# Altium schematic sheet 06.SchDoc
size 386 x 246 mm
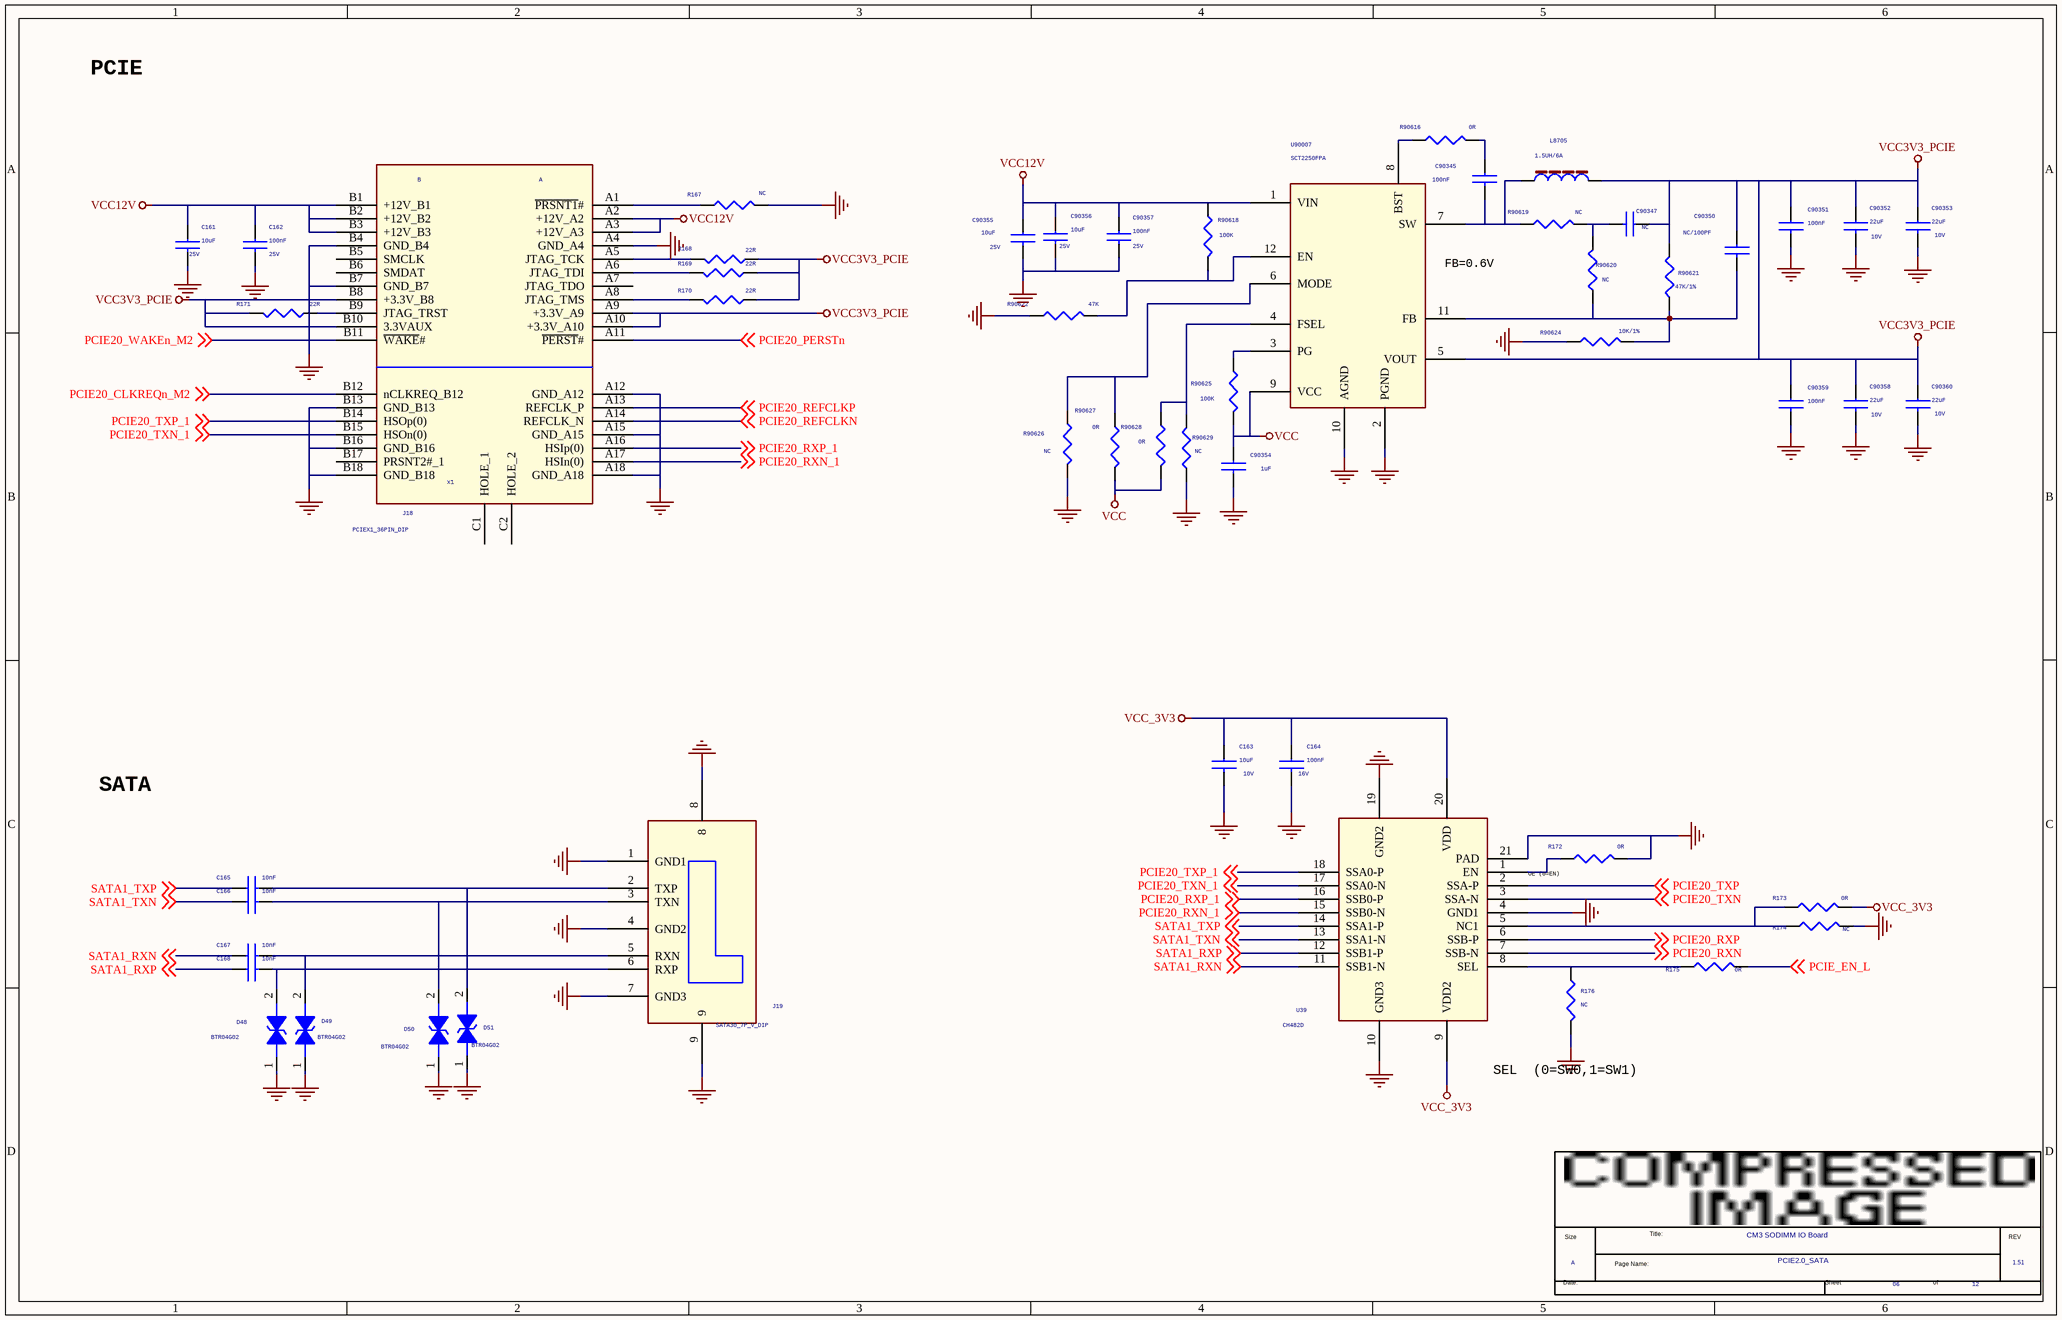
[diagram p0: 06.SchDoc]

## Parts
*  Page Count: 12  Page Number: 06  Page Size: A  Title: CM3 SODIMM IO Board  RevCode: 1.51  Doc: PCIE2.0_SATA  (hidden comment: radxa_1010)  (graphical)
C161  10uF  Voltage: 25V  [C1206]
C162  100nF  Voltage: 25V  [C0402]
C163  10uF  Voltage: 10V  [C0603]
C164  100nF  Voltage: 16V  [C0402]
C165  10nF  [C0402]
C166  10nF  [C0402]
C167  10nF  [C0402]
C168  10nF  [C0402]
C90345  100nF  [C0201]
C90347  NC  [C0201]
C90350  NC/100PF  [C0201]
C90351  100nF  [C0201]
C90352  22uF  Voltage: 10V  [C0603]
C90353  22uF  Voltage: 10V  [C0603]
C90354  1uF  [C0201]
C90355  10uF  Voltage: 25V  [C0805]
C90356  10uF  Voltage: 25V  [C0805]
C90357  100nF  Voltage: 25V  [C0402]
C90358  22uF  Voltage: 10V  [C0603]
C90359  100nF  [C0201]
C90360  22uF  Voltage: 10V  [C0603]
D48  BTR04G02  [ESD0402_1xD5]
D49  BTR04G02  [ESD0402_1xD5]
D50  BTR04G02  [ESD0402_1xD5]
D51  BTR04G02  [ESD0402_1xD5]
J18  PCIEX1_36PIN_DIP  [PCIEX1_36PIN_DIP]
J19  SATA30_7P_V_DIP  [SMD_SATA_7P_50_180]
L8705  1.5UH/6A  [IND-5X5]
R167  NC  [R0402]
R168  22R  [R0402]
R169  22R  [R0402]
R170  22R  [R0402]
R171  22R  [R0402]
R172  0R  [R0402]
R173  0R  [R0402]
R174  NC  [R0402]
R175  0R  [R0402]
R176  NC  [R0402]
R90616  0R  [R0402]
R90618  100K  [R0402]
R90619  NC  [R0402]
R90620  NC  [R0402]
R90621  47K/1%  [R0402]
R90622  47K  [R0402]
R90624  10K/1%  [R0402]
R90625  100K  [R0402]
R90626  NC  [R0402]
R90627  0R  [R0402]
R90628  0R  [R0402]
R90629  NC  [R0402]
U39  CH482D  [CH482X]
U90007  SCT2250FPA  [QFN12_3R00X2R00X0R90]

## Nets
GND: C161.2 C162.2 C163.2 C164.2 C90351.2 C90352.2 C90353.2 C90354.2 C90355.2 C90356.2 C90357.2 C90358.2 C90359.2 C90360.2 D48.1 D49.1 D50.1 D51.1 J18.A4(GND_A4) J18.A12(GND_A12) J18.A15(GND_A15) J18.A18(GND_A18) J18.B4(GND_B4) J18.B7(GND_B7) J18.B13(GND_B13) J18.B16(GND_B16) J18.B18(GND_B18) J19.1(GND1) J19.4(GND2) J19.7(GND3) J19.8 J19.9 R167.2 R172.1 R174.1 R176.2 R90622.2 R90624.2 R90626.1 R90629.1 U39.4(GND1) U39.10(GND3) U39.19(GND2) U39.21(PAD) U90007.2(PGND) U90007.10(AGND)
VCC: C90354.1 R90625.1 R90627.1 R90628.1 U90007.9(VCC)
VCC3V3_PCIE: C90347.1 C90350.1 C90351.1 C90352.1 C90353.1 C90358.1 C90359.1 C90360.1 J18.A9(+3.3V_A9) J18.A10(+3.3V_A10) J18.B8(+3.3V_B8) J18.B10(3.3VAUX) L8705.2 R168.2 R169.2 R170.2 R171.1 R90621.2 U90007.5(VOUT)
VCC12V: C161.1 C162.1 C90355.1 C90356.1 C90357.1 J18.A2(+12V_A2) J18.A3(+12V_A3) J18.B1(+12V_B1) J18.B2(+12V_B2) J18.B3(+12V_B3) R90618.2 U90007.1(VIN)
VCC_3V3: C163.1 C164.1 R173.1 U39.9(VDD2) U39.20(VDD)
PCIE20_CLKREQn_M2: J18.B12(nCLKREQ_B12) ; off-sheet PCIE20_CLKREQn_M2
PCIE20_PERSTn: J18.A11(~{PERST}#) ; off-sheet PCIE20_PERSTn
PCIE20_REFCLKN: J18.A14(REFCLK_N) ; off-sheet PCIE20_REFCLKN
PCIE20_REFCLKP: J18.A13(REFCLK_P) ; off-sheet PCIE20_REFCLKP
PCIE20_RXN: U39.7(SSB-N) ; off-sheet PCIE20_RXN
PCIE20_RXN_1: J18.A17(HSIn(0)) U39.15(SSB0-N) ; off-sheet PCIE20_RXN_1
PCIE20_RXP: U39.6(SSB-P) ; off-sheet PCIE20_RXP
PCIE20_RXP_1: J18.A16(HSIp(0)) U39.16(SSB0-P) ; off-sheet PCIE20_RXP_1
PCIE20_TXN: U39.3(SSA-N) ; off-sheet PCIE20_TXN
PCIE20_TXN_1: J18.B15(HSOn(0)) U39.17(SSA0-N) ; off-sheet PCIE20_TXN_1
PCIE20_TXP: U39.2(SSA-P) ; off-sheet PCIE20_TXP
PCIE20_TXP_1: J18.B14(HSOp(0)) U39.18(SSA0-P) ; off-sheet PCIE20_TXP_1
PCIE20_WAKEn_M2: J18.B11(~{WAKE}#) ; off-sheet PCIE20_WAKEn_M2
PCIE_EN_L: R175.1 ; off-sheet PCIE_EN_L
SATA1_RXN: C167.1 U39.11(SSB1-N) ; off-sheet SATA1_RXN
SATA1_RXP: C168.1 U39.12(SSB1-P) ; off-sheet SATA1_RXP
SATA1_TXN: C166.1 U39.13(SSA1-N) ; off-sheet SATA1_TXN
SATA1_TXP: C165.1 U39.14(SSA1-P) ; off-sheet SATA1_TXP
NetC165_2: C165.2 D51.2 J19.2(TXP)
NetC166_2: C166.2 D50.2 J19.3(TXN)
NetC167_2: C167.2 D49.2 J19.5(RXN)
NetC168_2: C168.2 D48.2 J19.6(RXP)
NetC90345_1: C90345.1 R90616.1
NetC90345_2: C90345.2 L8705.1 R90619.2 U90007.7(SW)
NetC90347_2: C90347.2 R90619.1 R90620.2
NetC90350_2: C90350.2 R90620.1 R90621.1 R90624.1 U90007.11(FB)
NetJ18_A1: J18.A1(~{PRSNT1}#) R167.1
NetJ18_A5: J18.A5(JTAG_TCK) R168.1
NetJ18_A6: J18.A6(JTAG_TDI) R169.1
NetJ18_A8: J18.A8(JTAG_TMS) R170.1
NetJ18_B9: J18.B9(JTAG_TRST) R171.2
NetR172_2: R172.2 U39.1(EN)
NetR173_2: R173.2 R174.2 U39.5(NC1)
NetR175_2: R175.2 R176.1 U39.8(SEL)
NetR90616_2: R90616.2 U90007.8(BST)
NetR90618_1: R90618.1 R90622.1 U90007.12(EN)
NetR90625_2: R90625.2 U90007.3(PG)
NetR90626_2: R90626.2 R90627.2 U90007.6(MODE)
NetR90628_2: R90628.2 R90629.2 U90007.4(FSEL)

Not connected (* = marked no-connect by the designer): J18 A7(JTAG_TDO) B5(SMCLK) B6(SMDAT) B17(PRSNT2#_1) C1(HOLE_1) C2(HOLE_2)

## Notes on the sheet
- PCIE
- (near U90007) FB=0.6V
- SATA
- (near R172) OE (0=EN)
- SEL  (0=SW0,1=SW1)
- (in symbol PCIE_4X_CON_1) B; x1
- (in symbol radxa_1010) Size; Title:; REV; Page Name:; Date:; Sheet; of

## Library data of the parts
C161 C90355 C90356 = CAP NP_0: cap,10.00uF,+/-10%,25V,X5R,C1206; Manufacturer PN: C3216X5R1E106K085AC; Manufacturer: TDK; Tolerance: 10%; C_Voltage: 6.3V; Priority: A; Dielectric: X5R; Created by: JJJ; Part Type: C1206; RK PN: C3216X5R1E106K085AC
C162 C90357 = CAP NP_0: cap,100.00nF,+/-10%,25V,X5R,C0402; Manufacturer: TDK; RK PN: C1005X5R1E104K050BC; Priority: A; Tolerance: 10%; Dielectric: X5R; Part Type: C0402; Manufacturer PN: C1005X5R1E104K050BC; Created by: JJJ
C163 = CAP NP_0: cap,22.00uF,+/-10%,10V,X5R,C0805; Manufacturer PN: C2012X5R1A226K125AB; Manufacturer: TDK; Tolerance: 10%; Priority: A; Dielectric: X5R; Created by: JJJ; Part Type: C0805; RK PN: C2012X5R1A226K125AB
C164 = CAP NP_0: cap,100.00nF,+/-10%,16V,X5R,C0402; Manufacturer PN: C1005X5R1C104K050BA; Manufacturer: TDK; Tolerance: 10%; Priority: A; Dielectric: X5R; Created by: JJJ; Part Type: C0402; RK PN: C1005X5R1C104K050BA
C165-C168 = CAP NP_0: cap,10.00nF,+/-10%,10V,X7R,C0201; Manufacturer: TDK; RK PN: C0603X7R1A103K030BA; Priority: A; Tolerance: 10%; Dielectric: X7R; Voltage: 10V; Part Type: C0201; Manufacturer PN: C0603X7R1A103K030BA; Created by: JJJ
C90345 C90347 C90350 C90351 C90354 C90359 = CAP NP_0_Dup1: Priority: A
C90352 C90353 = CAP NP_0_Dup1: cap,22.00uF,+/-10%,10V,X5R,C0805; Manufacturer: TDK; RK PN: C2012X5R1A226K125AB; Priority: A; Tolerance: 10%; Dielectric: X5R; Part Type: C0805; Manufacturer PN: C2012X5R1A226K125AB; Created by: JJJ
C90358 C90360 = CAP NP_0_Dup1: cap,22.00uF,+/-10%,10V,X5R,C0805; Manufacturer PN: C2012X5R1A226K125AB; Manufacturer: TDK; Tolerance: 10%; Priority: A; Dielectric: X5R; Created by: JJJ; Part Type: C0805; RK PN: C2012X5R1A226K125AB
D48 = DIODE BI_DIR TRIG: 1-Line, Bi-directional, Transient Voltage Suppressors.17.5pF.; Manufacturer PN: ESD5451N; Manufacturer: WillSemi(韦尔半导体); OPTION: DNP; Priority: A; Created by: JJJ; Part Type: ESD_TVS; RK PN: ESD5451N
D49-D51 = DIODE BI_DIR TRIG: 1-Line, Bi-directional, Transient Voltage Suppressors.17.5pF.; Manufacturer: WillSemi(韦尔半导体); RK PN: ESD5451N; Priority: A; OPTION: DNP; Part Type: ESD_TVS; Manufacturer PN: ESD5451N; Created by: JJJ
J18 = PCIE_4X_CON_1: PCIE 4X座子，立式，SMT；; Manufacturer Part Number: PCIE64_SMT; Priority: A; Part Type: PCIE; RK PN: PCIE64_SMT
J19 = SATA_DIP_1
L8705 = INDUCTOR_2: A: TMPC0402HG-1R5M
R167 = RESISTOR_0: 通用厚膜电阻,0R,+/-5%,R0402,1/16W.; Manufacturer: YAGEO; Tolerance: 5%; RK PN: RC0402JR-070RL; Priority: A; Wattage: 1/16W; Part Type: 通用厚膜电阻; Manufacturer PN: RC0402JR-070RL; Created by: YTL
R168-R171 = RESISTOR_0: 通用厚膜电阻,10K,+/-5%,R0402,1/16W.; Manufacturer PN: RC0402JR-0710KL; Manufacturer: YAGEO; Tolerance: 5%; Wattage: 1/16W; Priority: A; Created by: YTL; Part Type: 通用厚膜电阻; RK PN: RC0402JR-0710KL
R172-R174 = RESISTOR_0: 通用厚膜电阻,0R,+/-5%,R0402,1/16W.; Manufacturer PN: RC0402JR-070RL; Manufacturer: YAGEO; Tolerance: 5%; Wattage: 1/16W; Priority: A; Created by: YTL; Part Type: 通用厚膜电阻; RK PN: RC0402JR-070RL
R175 = RESISTOR_0: 通用厚膜电阻,100R,+/-5%,R0402,1/16W.; Manufacturer: YAGEO; Tolerance: 5%; RK PN: RC0402JR-07100RL; Priority: A; Wattage: 1/16W; Part Type: 通用厚膜电阻; Manufacturer PN: RC0402JR-07100RL; Created by: YTL
R176 = RESISTOR_0: 通用厚膜电阻,4K7,+/-5%,R0402,1/16W.; Manufacturer PN: RC0402JR-074K7L; Manufacturer: YAGEO; Tolerance: 5%; Wattage: 1/16W; Priority: A; Created by: YTL; Part Type: 通用厚膜电阻; RK PN: RC0402JR-074K7L
R90616 R90618-R90622 R90624-R90629 = RESISTOR_0_Dup2: Priority: A
U39 = CH482X
U90007 = DCDC_NB679_4: 26 V, Low Iq, High Current, Fixed 5 V-8 A Synchronous Buck Converter with 100 mA LDO;; Manufacturer: MPS （美国芯源）; RK PN: NB679GD; Priority: A; Part Type: DCDC; Manufacturer PN: NB679GD; Created by: JJJ
* = radxa_1010: Page Create Date: March  8, 1995